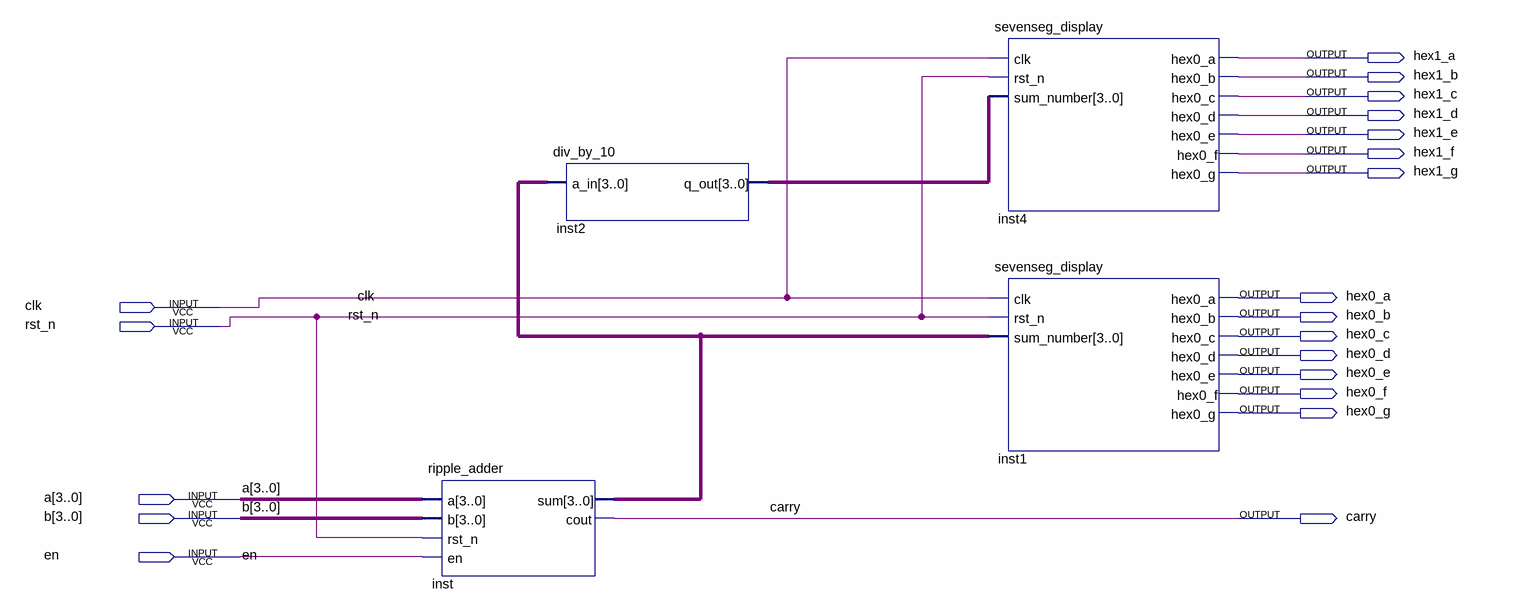
[diagram p0: schematic sheet]
// Quartus schematic ripple_adder_display.bdf as structural Verilog: 4 symbols, 20 pins
module ripple_adder_display (
  input  clk,
  input  rst_n,
  input  [3:0] a,
  input  [3:0] b,
  input  en,
  output hex1_a,
  output hex1_b,
  output hex1_c,
  output hex1_d,
  output hex1_e,
  output hex1_f,
  output hex1_g,
  output hex0_a,
  output hex0_b,
  output hex0_c,
  output hex0_d,
  output hex0_e,
  output hex0_f,
  output hex0_g,
  output carry
);

  wire [3:0] inst2_q_out, inst_sum;

  ripple_adder inst (.a(a), .b(b), .rst_n(rst_n), .en(en), .sum(inst_sum), .cout(carry));
  div_by_10 inst2 (.a_in(inst_sum), .q_out(inst2_q_out));
  sevenseg_display inst4 (
    .clk(clk), .rst_n(rst_n), .sum_number(inst2_q_out), .hex0_a(hex1_a), .hex0_b(hex1_b), .hex0_c(hex1_c),
    .hex0_d(hex1_d), .hex0_e(hex1_e), .hex0_f(hex1_f), .hex0_g(hex1_g));
  sevenseg_display inst1 (
    .clk(clk), .rst_n(rst_n), .sum_number(inst_sum), .hex0_a(hex0_a), .hex0_b(hex0_b), .hex0_c(hex0_c),
    .hex0_d(hex0_d), .hex0_e(hex0_e), .hex0_f(hex0_f), .hex0_g(hex0_g));
endmodule
